# EAGLE design topshell2_actual (EAGLE 9.5.2)
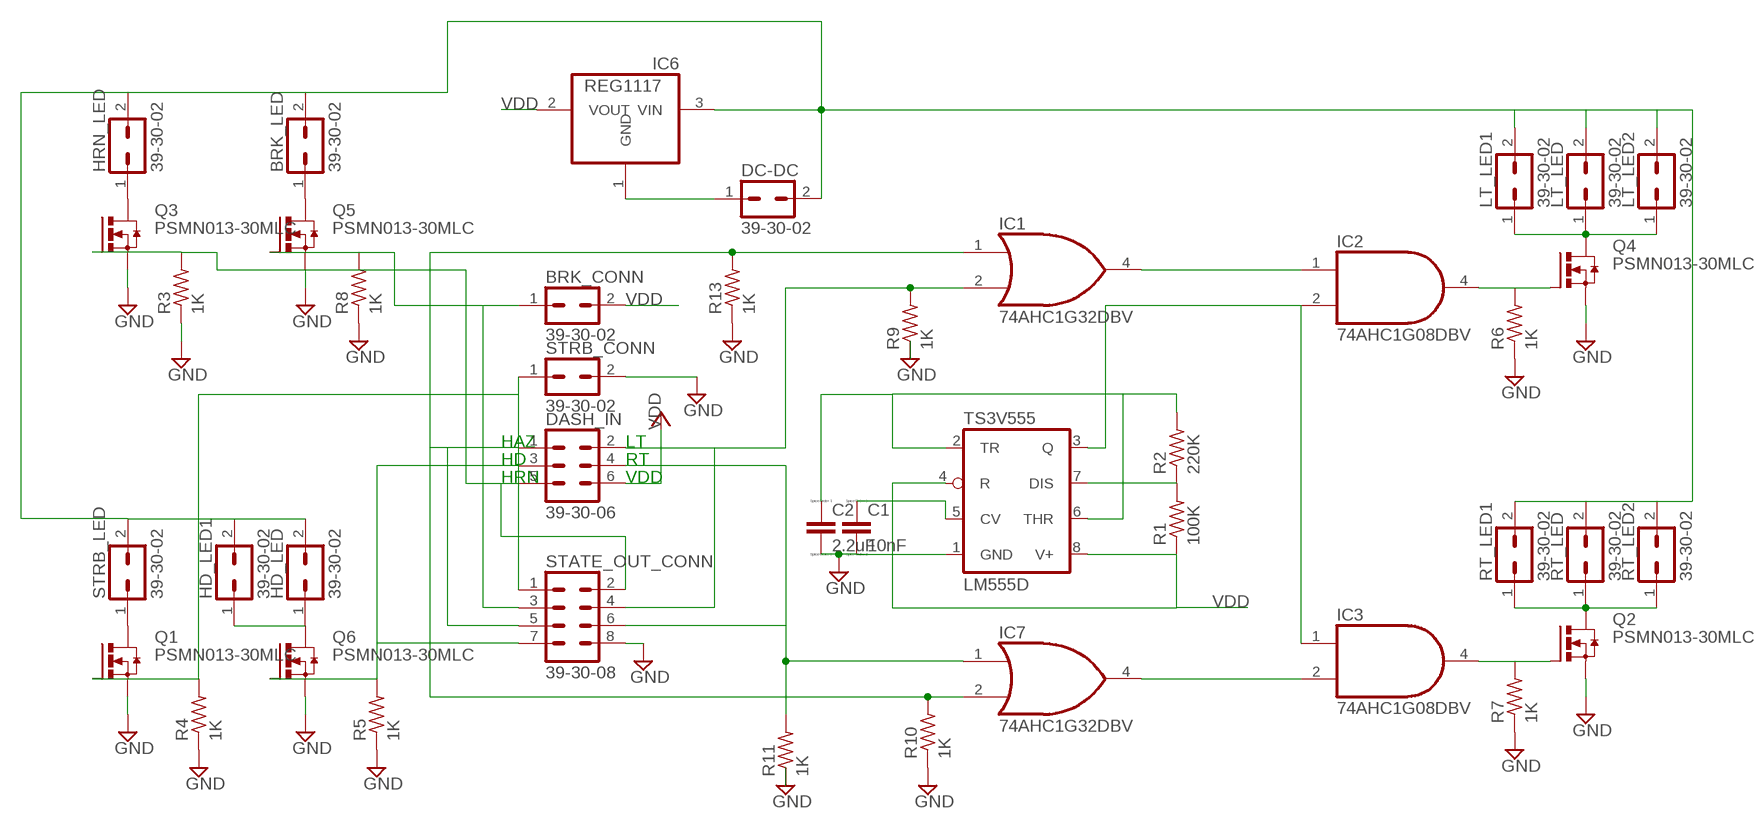
[diagram p0: schematic, sheet 1]

## Parts
BRK_CONN  39-30-02  [39-30-?02?]
BRK_LED  39-30-02  [39-30-?02?]
C1  10nF  C  [C0805]
C2  2.2uF  C  [C0805]
DASH_IN  39-30-06  [39-30-?06?]
DC-DC  39-30-02  [39-30-?02?]
HD_LED  39-30-02  [39-30-?02?]
HD_LED1  39-30-02  [39-30-?02?]
HRN_LED  39-30-02  [39-30-?02?]
IC1  74AHC1G32DBV  [SOT23-5]
IC2  74AHC1G08DBV  [SOT23-5]
IC3  74AHC1G08DBV  [SOT23-5]
IC6  REG1117  [SOT223]
IC7  74AHC1G32DBV  [SOT23-5]
LT_LED  39-30-02  [39-30-?02?]
LT_LED1  39-30-02  [39-30-?02?]
LT_LED2  39-30-02  [39-30-?02?]
Q1  PSMN013-30MLC  [LFPAK33]
Q2  PSMN013-30MLC  [LFPAK33]
Q3  PSMN013-30MLC  [LFPAK33]
Q4  PSMN013-30MLC  [LFPAK33]
Q5  PSMN013-30MLC  [LFPAK33]
Q6  PSMN013-30MLC  [LFPAK33]
R1  100K  R-US_R0805  [R0805]
R2  220K  R-US_R0805  [R0805]
R3  1K  R-US_R0805  [R0805]
R4  1K  R-US_R0805  [R0805]
R5  1K  R-US_R0805  [R0805]
R6  1K  R-US_R0805  [R0805]
R7  1K  R-US_R0805  [R0805]
R8  1K  R-US_R0805  [R0805]
R9  1K  R-US_R0805  [R0805]
R10  1K  R-US_R0805  [R0805]
R11  1K  R-US_R0805  [R0805]
R13  1K  R-US_R0805  [R0805]
RT_LED  39-30-02  [39-30-?02?]
RT_LED1  39-30-02  [39-30-?02?]
RT_LED2  39-30-02  [39-30-?02?]
STATE_OUT_CONN  39-30-08  [39-30-?08?]
STRB_CONN  39-30-02  [39-30-?02?]
STRB_LED  39-30-02  [39-30-?02?]
TS3V555  LM555D  [SO08]

## Nets
GND: C1.2 C2.2 Q1.1(S) Q1.2(S) Q1.3(S) Q2.1(S) Q2.2(S) Q2.3(S) Q3.1(S) Q3.2(S) Q3.3(S) Q4.1(S) Q4.2(S) Q4.3(S) Q5.1(S) Q5.2(S) Q5.3(S) Q6.1(S) Q6.2(S) Q6.3(S) R3.1 R4.1 R5.1 R6.1 R7.1 R8.1 R9.1 R10.1 R11.1 R13.1 STATE_OUT_CONN.8 STRB_CONN.2 TS3V555.1(GND)
N$1: R1.2 R2.1 TS3V555.7(DIS)
N$2: Q1.MB(D) STRB_LED.1
N$3: C2.1 R2.2 TS3V555.2(TR) TS3V555.6(THR)
N$4: IC2.2(I1) IC3.1(I0) TS3V555.3(Q)
N$5: HRN_LED.1 Q3.MB(D)
N$6: Q1.4(G) R4.2 STATE_OUT_CONN.1 STRB_CONN.1
N$7: DASH_IN.2 IC1.2(I1) R9.2 STATE_OUT_CONN.4
N$8: DASH_IN.1 IC1.1(I0) IC7.2(I1) R10.2 R13.2 STATE_OUT_CONN.5
N$9: IC1.4(O) IC2.1(I0)
N$10: IC3.2(I1) IC7.4(O)
N$11: DASH_IN.4 IC7.1(I0) R11.2 STATE_OUT_CONN.6
N$12: IC2.4(O) Q4.4(G) R6.2
N$13: IC3.4(O) Q2.4(G) R7.2
N$14: LT_LED1.1 LT_LED2.1 LT_LED.1 Q4.MB(D)
N$15: Q2.MB(D) RT_LED1.1 RT_LED2.1 RT_LED.1
N$16: BRK_LED.1 Q5.MB(D)
N$17: HD_LED1.1 HD_LED.1 Q6.MB(D)
N$18: DC-DC.1 IC6.1(GND)
N$19: DASH_IN.3 Q6.4(G) R5.2 STATE_OUT_CONN.7
N$20: Q3.4(G) R3.2
N$21: DASH_IN.5 STATE_OUT_CONN.2
N$23: BRK_CONN.1 Q5.4(G) R8.2 STATE_OUT_CONN.3
N$26: BRK_LED.2 DC-DC.2 HD_LED1.2 HD_LED.2 HRN_LED.2 IC6.3(VIN) LT_LED1.2 LT_LED2.2 LT_LED.2 RT_LED1.2 RT_LED2.2 RT_LED.2 STRB_LED.2
TS3V555: C1.1 TS3V555.5(CV)
VDD: BRK_CONN.2 DASH_IN.6 IC6.2(VOUT) R1.1 TS3V555.4(R) TS3V555.8(V+) ; supply symbol labelled VCC

## Notes on the sheet
- HAZ | LT
- HD | RT
- HRN | VDD

## Power pins joined to a net without a drawn wire
GND: IC1.3(GND) IC2.3(GND) IC3.3(GND) IC7.3(GND)
VDD: IC1.5(VCC) IC2.5(VCC) IC3.5(VCC) IC7.5(VCC)

## Library data of the parts
BRK_CONN BRK_LED DC-DC HD_LED HD_LED1 HRN_LED LT_LED LT_LED1 LT_LED2 RT_LED RT_LED1 RT_LED2 STRB_CONN STRB_LED = con-molex-mini-fit:39-30-?02?: HEADER
C1 C2 = eagle-ltspice:C: CAPACITOR, European symbol; SPICEMODEL: NONE; SPICEPREFIX: C
DASH_IN = con-molex-mini-fit:39-30-?06?: HEADER
IC1 IC7 = 74xx-little-us:74*1G32: 2-input OR gate
IC2 IC3 = 74xx-little-us:74*1G08: 2-input AND gate
IC6 = burr-brown:REG1117: 800mA and 1A Low Dropout (LDO) Positive Regulator 1.8V, 2.5V, 2.85V, 3.3V, 5V, and Adj; MPN: REG1117; OC_FARNELL: 1097566; OC_NEWARK: 14P6981
Q1-Q6 = transistor-power:PSMN013-30MLC: N-channel 30 V 13.6 mΩ logic level MOSFET NextPower Technology Source: Data sheet <http://www.nxp.com/documents/data_sheet/PSMN013-30MLC.pdf> PSMN013-30MLC © NXP B.V. 2012. All rights reserved.; MPN: PSMN013-30MLC; OC_FARNELL: 2115260; OC_NEWARK: 05W5709
R1-R11 R13 = rcl:R-US_: RESISTOR, American symbol
STATE_OUT_CONN = con-molex-mini-fit:39-30-?08?: HEADER
TS3V555 = linear:*555: TIMER

## Board
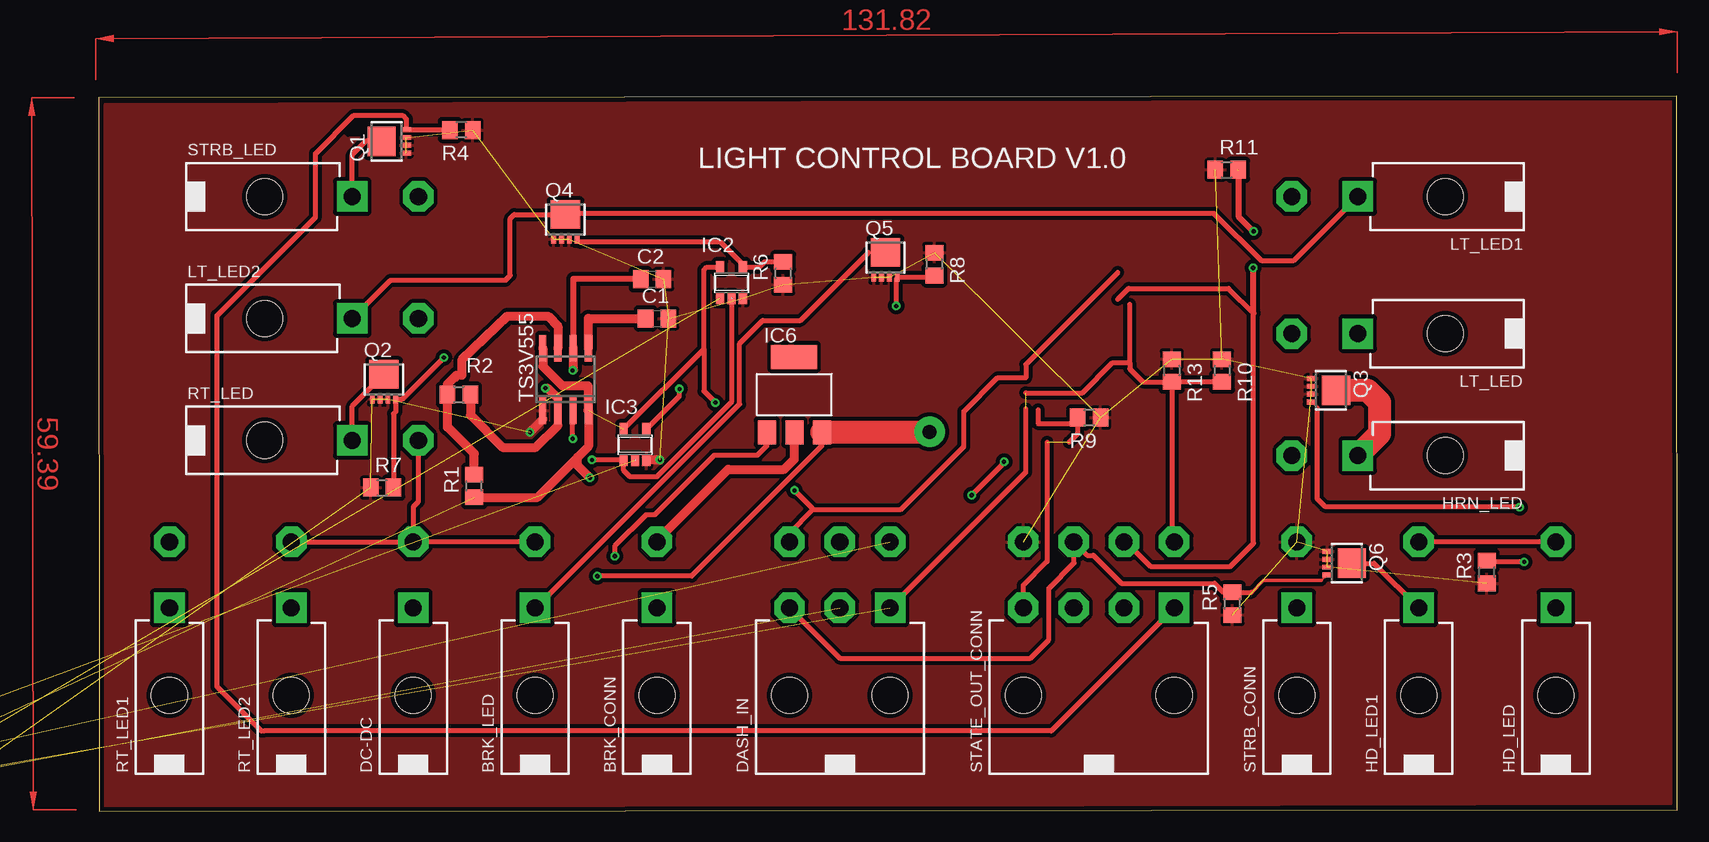
[diagram p1: board, top side]
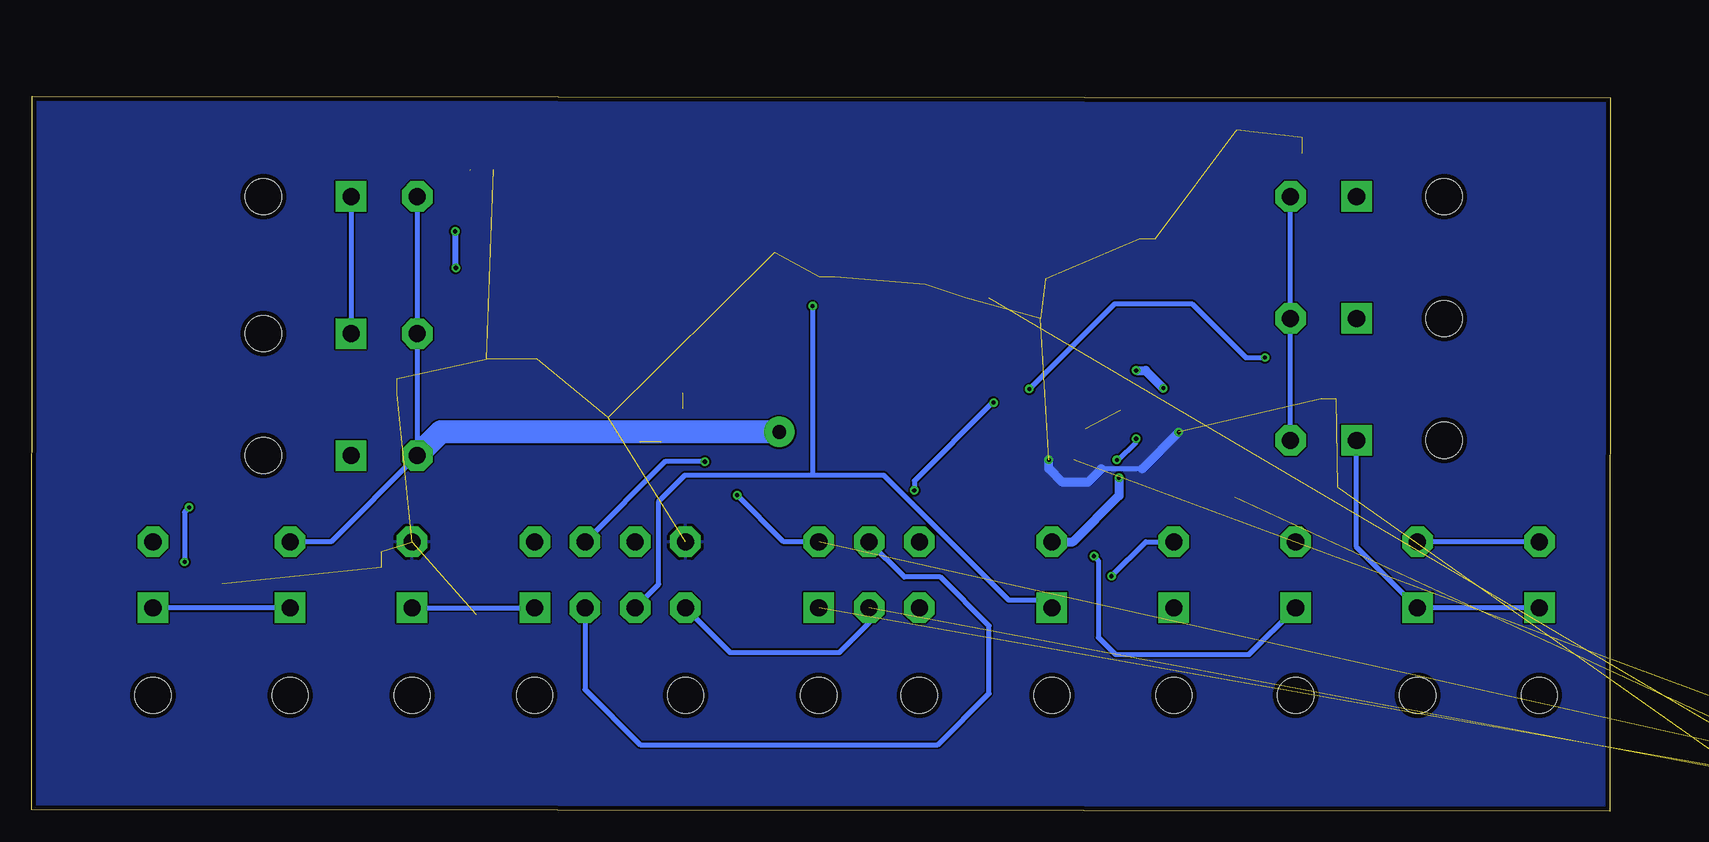
[diagram p2: board, bottom side, seen from below]

Size 131.59 x 59.64 mm. Coordinates in mm from the lower left corner, seen from the top.
Outline: 0.05,0 131.58,0.12 131.54,59.64 0,59.51 0.05,0
Copper layers (1*16): Top 0.0356mm / dielectric 1.5011mm / Bottom 0.0356mm
Design rules "LaenPCBOrder": minimum track width 6mil, minimum drill 13mil, track to track 6mil, track to pad 6mil, pad to pad 6mil, via to via 6mil, smd to smd 6mil, copper to edge 15mil, drill to drill 6mil, minimum pad ring 7mil, minimum via ring 7mil, stop-mask expansion 3mil, vias tented up to drill 0mil, thermal gap 10mil

### Footprints (pad centres in the part's own frame; a part is rotated, then mirrored left to right if it is on the bottom)
39-30-?02? = drill 1.422 pad 2.54 square: 1 0,0 | drill 1.422 pad 2.54 octagon: 2 0,5.512 | hole 3: 0,-7.3
C0805 = smd 1.3 x 1.5: 1 -0.95,0; 2 0.95,0
39-30-?06? = drill 1.422 pad 2.54 square: 1 4.191,0 | drill 1.422 pad 2.54 octagon: 2 0,0; 3 -4.191,0; 4 4.191,5.512; 5 0,5.512; 6 -4.191,5.512 | hole 3: -4.191,-7.3; 4.191,-7.3
SOT23-5 = smd 0.69 x 0.99: 1 -0.95,-1.29; 2 0,-1.29; 3 0.95,-1.29; 4 0.95,1.3; 5 -0.95,1.3
SOT223 = smd 1.499 x 2.007: 1 -2.261,-3.15; 2 0.025,-3.15; 3 2.311,-3.15 | smd 3.81 x 2.007: 4 0,3.15
LFPAK33 = smd 0.4 x 0.8: 1 -0.975,-1.625; 2 -0.325,-1.625; 3 0.325,-1.625; 4 0.975,-1.625 | smd 2.45 x 2.35: MB 0,0.425
R0805 = smd 1.3 x 1.5: 1 -0.95,0; 2 0.95,0
39-30-?08? = drill 1.422 pad 2.54 square: 1 6.287,0 | drill 1.422 pad 2.54 octagon: 2 2.095,0; 3 -2.095,0; 4 -6.287,0; 5 6.287,5.512; 6 2.095,5.512; 7 -2.095,5.512; 8 -6.287,5.512 | hole 3: -6.287,-7.3; 6.287,-7.3
SO08 = smd 0.6 x 2.2: 1 -1.905,-2.6; 2 -0.635,-2.6; 3 0.635,-2.6; 4 1.905,-2.6; 5 1.905,2.6; 6 0.635,2.6; 7 -0.635,2.6; 8 -1.905,2.6

### Placement (x,y rotation side)
BRK_CONN  39-30-02?  [39-30-?02?]  46.54,16.98 0 top
BRK_LED  39-30-02?  [39-30-?02?]  36.38,16.98 0 top
C1  46.54,41.11 0 top
C2  46.13,44.39 0 top
DASH_IN  39-30-06?  [39-30-?06?]  61.78,16.98 0 top
DC-DC  39-30-02?  [39-30-?02?]  26.22,16.98 0 top
HD_LED  39-30-02?  [39-30-?02?]  121.47,16.98 0 top
HD_LED1  39-30-02?  [39-30-?02?]  110.04,16.98 0 top
HRN_LED  39-30-02?  [39-30-?02?]  104.96,29.68 90 top
IC1  -12.39,4.25 0 top  (outside the outline)
IC2  52.75,44.08 0 top
IC3  44.71,30.58 0 top
IC6  57.97,34.76 0 top
IC7  -20.21,4.25 0 top  (outside the outline)
LT_LED  39-30-02?  [39-30-?02?]  104.96,39.84 90 top
LT_LED1  39-30-02?  [39-30-?02?]  104.96,51.27 90 top
LT_LED2  39-30-02?  [39-30-?02?]  21.14,41.11 270 top
Q1  24.02,55.88 90 top
Q2  23.79,36.03 0 top
Q3  102.73,35.13 270 top
Q4  38.91,49.36 0 top
Q5  65.59,46.19 0 top
Q6  104.03,20.7 270 top
R1  31.3,27.14 90 top
R2  30.03,34.76 0 top
R3  115.71,19.97 90 top
R4  30.23,56.83 180 top
R5  94.51,17.33 90 top
R6  57.07,44.87 90 top
R7  23.63,27 0 top
R8  69.66,45.64 270 top
R9  82.57,32.83 180 top
R10  93.64,36.77 270 top
R11  94.03,53.5 0 top
R13  89.44,36.77 270 top
RT_LED  39-30-02?  [39-30-?02?]  21.14,30.95 270 top
RT_LED1  39-30-02?  [39-30-?02?]  5.9,16.98 0 top
RT_LED2  39-30-02?  [39-30-?02?]  16.06,16.98 0 top
STATE_OUT_CONN  39-30-08?  [39-30-?08?]  83.37,16.98 0 top
STRB_CONN  39-30-02?  [39-30-?02?]  99.88,16.98 0 top
STRB_LED  39-30-02?  [39-30-?02?]  21.14,51.27 270 top
TS3V555  38.92,36.03 0 top

### Tracks (layer width: path | path; a pad name or v marks a point on that pad's centre or on a via)
GND  (via drill 0.35)  (35 unrouted)
  Top 0.152: TS3V555.1 37.01,32.69 | v46.78,29.31 46.76,29.29
  Top 0.762: 37.01,32.69 v35.95,31.63 | 46.76,29.29 IC3.3
  Bottom 0.406: 39,28.58 42.41,28.58
  Bottom 0.762: v35.95,31.63 39,28.58 | 42.41,28.58 43.54,27.45 45.64,27.45 46.78,28.59 v46.78,29.31
  pour Top (isolate 0.33): 0.44,0.29 131.12,0.66 131.12,59.34 0.48,58.98 0.48,0.49
  pour Bottom: -0.01,59.54 -0.01,0.01 131.6,0.01 131.61,0.03 131.61,59.56 131.57,59.6 131.49,59.52 0,59.52
N$1
  Top 0.406: R2.1 29.08,34.59 29.05,34.56 | 29.8,36.35 29.8,36.05 30.13,36.38 30.13,36.53 30.27,36.39
  Top 0.762: R1.2 31.3,29.83 29.08,32.05 R2.1 | 29.8,36.35 29.05,35.61 29.05,34.56 | 30.27,36.39 30.27,37.63 34.07,41.29 37.44,41.29 38.28,40.45 TS3V555.7
N$2
  Top 0.152: 23.99,56.33 Q1.MB
  Top 0.406: Q1.MB 22.27,55.88 21.14,54.75 STRB_LED.1
N$3  (via drill 0.35)
  Top 0.152: R2.2 | 38.28,32.2 TS3V555.2 38.28,34.42 | 39.55,36.82 v39.51,36.78
  Top 0.508: C2.1 39.57,44.39 | 39.57,44.39 39.59,44.41 | 39.59,44.41 | 39.59,44.41 39.64,44.35 | 39.57,44.39 39.55,44.37 TS3V555.6
  Top 0.762: R2.2 30.99,33.04 33.68,30.35 36.44,30.35 38.28,32.2 | TS3V555.6 39.55,36.82 | v37.24,35.3 37.4,35.3 38.28,34.42
  Bottom 0.152: 37.26,35.3 v37.24,35.3
  Bottom 0.762: v39.51,36.78 38.74,36.78 37.26,35.3
N$4  (via drill 0.35)
  Top 0.152: IC2.2 | 41.15,29.29 v41.13,29.31 | 39.51,33.38 TS3V555.3
  Top 0.406: IC2.2 52.74,34.13 46.52,27.91 44.29,27.91 43.76,28.44 IC3.1 41.15,29.29 | v39.51,31.08 39.51,33.38
  Bottom 0.152: 39.51,30.82 v39.51,31.08
  Bottom 0.406: v41.13,29.31 41.02,29.31 39.51,30.82
N$5
  Top 1.905: HRN_LED.1 106.76,31.49 106.76,34.12 105.76,35.13 Q3.MB
N$6
  Top 0.152: 13.79,6.73 13.56,6.73
  Top 0.406: STATE_OUT_CONN.1 79.4,6.73 13.79,6.73 | 13.56,6.73 9.87,10.41 9.87,41.36 18.07,49.56 18.07,54.85 21.26,58.05 25.33,58.05 25.64,57.73 Q1.4 29.25,56.85 R4.2
  Bottom 0.406: STRB_CONN.1 STATE_OUT_CONN.1
N$7  (2 unrouted)
  Top 0.406: STATE_OUT_CONN.4 77.08,18.85 79.06,20.83 79.06,30.79 | R9.2 81.62,33.18 | R9.2 81.1,32.32 80.05,32.32 80.05,32.31 78.36,32.31 78.31,32.36 78.31,33.52 | 80.9,30.79 81.62,31.51 R9.2 | R9.2
  Bottom 0.406: STATE_OUT_CONN.4 73.37,13.27 64.25,13.27 61.78,15.74 DASH_IN.2
N$8  (3 unrouted)
  Top 0.152: 89.44,22.7 STATE_OUT_CONN.5
  Top 0.406: R10.2 R13.2 | R13.2 87.04,35.82 85.96,36.9 85.96,37.43 | 85.96,37.43 85.96,42.31 | 77.29,34.91 82,34.91 84.52,37.43 85.96,37.43 | DASH_IN.1 77.29,28.3 77.29,30.89 77.29,32.32 | R13.2 89.5,35.76 89.5,22.65 STATE_OUT_CONN.5 | 77.29,32.32 77.29,33.59 | 77.29,32.32
N$9  (1 unrouted)
N$10  (1 unrouted)
N$11  (via drill 0.35)  (2 unrouted)
  Top 0.152: STATE_OUT_CONN.6 85.63,22.49
  Top 0.406: 85.63,22.49 87.73,20.39 94.29,20.39 96.26,22.36 96.26,41.54 94.19,43.62 85.85,43.62 84.96,42.72 | v72.78,26.37 75.47,29.07 v75.47,29.17
  Top 0.508: 96.26,41.54 96.26,45.29 v96.23,45.32 | 95.02,53.44 95.02,49.62 v96.27,48.37
  Bottom 0.406: DASH_IN.4 68.9,22.49 v72.78,26.37 | v75.47,29.17 78.79,29.17 STATE_OUT_CONN.6
  Bottom 0.508: v96.23,45.32 96.23,48.2 96.27,48.24 v96.27,48.37
N$12
  Top 0.152: IC2.4 53.7,45.61 | 40.14,47.47 Q4.4
  Top 0.406: IC2.4 53.72,45.4 55.1,45.4 55.47,45.77 55.47,45.84 57.04,45.84 R6.2 | 53.7,45.61 53.15,46.16 51.83,47.47 40.14,47.47
N$13  (via drill 0.35)
  Top 0.406: R7.2 24.58,33.16 24.76,33.34 Q2.4 25.34,34.41 v28.78,37.85 | IC3.4 48.41,34.63 v48.41,35.23
  Bottom 0.406: v48.41,35.23 41.29,42.35 34.87,42.35 30.37,37.85 v28.78,37.85
N$14
  Top 0.152: Q4.MB 38.99,49.87
  Top 0.406: 38.79,49.78 Q4.MB 34.64,49.78 34.3,49.45 34.3,44.7 33.89,44.28 24.31,44.28 LT_LED2.1 | 38.99,49.87 92.97,49.87 96.9,45.94 99.62,45.94 LT_LED1.1
  Bottom 0.406: LT_LED1.1 LT_LED.1
N$15
  Top 0.406: RT_LED.1 21.14,33.81 Q2.MB
  Bottom 0.152: 16.23,17.15 RT_LED2.1 16.23,17.15
  Bottom 0.406: 16.23,17.15 21.14,22.06 RT_LED.1 | RT_LED1.1 RT_LED2.1
N$16
  Top 0.152: 64.16,46.61 Q5.MB
  Top 0.406: BRK_LED.1 36.43,16.98 53.42,33.97 53.42,39.02 55.35,40.94 58.49,40.94 64.16,46.61
N$17
  Top 0.406: Q6.MB 106.31,20.7 HD_LED1.1
  Bottom 0.406: HD_LED1.1 HD_LED.1
N$18  (via drill 0.35)
  Top 0.152: IC6.1 55.71,30.52
  Top 0.406: 55.71,30.52 54.88,29.69 51.31,29.69 46.34,24.73 45.63,24.73 43.02,22.13 v43.02,21.28
  Bottom 0.406: DC-DC.1 30.11,13.08 41.24,13.08 42.67,14.51 42.67,20.93 v43.02,21.28
N$19
  Top 0.152: 81.3,22.46 STATE_OUT_CONN.7 | 93.76,18.27 R5.2 | 101.92,19.25 Q6.4
  Top 0.305: 96.11,18.27 97.08,19.25 101.92,19.25
  Top 0.406: 93.76,18.27 93.01,19.02 85.25,19.02 82.9,21.37 82.39,21.37 81.3,22.46 81.3,20.71 79.2,18.61 79.2,14.33 77.66,12.79 61.78,12.79 DASH_IN.3 | R5.2 96.11,18.27
N$20  (via drill 0.35)
  Top 0.152: 101.59,33.67 Q3.4 | 118.36,25.45 v118.45,25.35 | 115.82,20.81 R3.2
  Top 0.406: 101.59,33.67 101.59,26.07 102.2,25.45 114.16,25.45 118.36,25.45 | v118.83,20.81 115.82,20.81
  Bottom 0.406: v118.45,25.35 118.83,24.97 v118.83,20.81
N$21
  Bottom 0.152: 80.86,5.56 80.79,5.49
  Bottom 0.406: STATE_OUT_CONN.2 85.46,10.16 80.86,5.56 56.05,5.56 51.77,9.84 51.77,15.48 55.84,19.54 58.83,19.54 DASH_IN.5
N$23  (via drill 0.35)
  Top 0.152: Q5.4 66.64,44.56 66.49,44.41 | 69.54,44.56 R8.2
  Top 0.406: 66.64,44.56 69.54,44.56 | v66.49,42.15 66.49,44.41
  Bottom 0.152: 66.59,28.04 66.44,28.04 | 66.44,42.11 v66.49,42.15
  Bottom 0.406: STATE_OUT_CONN.3 79.31,18.95 79.31,25.86 77.13,28.04 66.59,28.04 60.56,28.04 50.15,17.64 47.2,17.64 BRK_CONN.1 | 66.44,28.04 66.44,42.11
N$26  (via drill 0.35, 1.14 pad 2.54)
  Top 0.152: 60.26,31.59 IC6.3
  Top 0.406: RT_LED2.2 DC-DC.2 | RT_LED.2 26.64,25.82 26.25,25.43 26.25,23.19 26.22,23.16 DC-DC.2 | BRK_LED.2 DC-DC.2 | HD_LED.2 HD_LED1.2 | 60.26,31.59 60.26,30.47 49.43,19.63 v41.56,19.63
  Top 1.905: IC6.3 60.32,31.65 v69.26,31.65
  Bottom 0.406: RT_LED.2 LT_LED2.2 STRB_LED.2 | RT_LED1.2 RT_LED2.2 | LT_LED1.2 LT_LED.2 HRN_LED.2 106.63,22.49 HD_LED1.2 | v41.56,19.63 38.7,22.49 BRK_LED.2
  Bottom 1.905: v69.26,31.65 97.47,31.65 HRN_LED.2
NOTGND
  cutout Top: 21.41,57.77 25.31,57.77 25.39,57.69 25.39,56.47 20.79,56.47 20.65,56.62 20.65,57.01
TS3V555
  Top 0.762: TS3V555.5 40.82,41.11 C1.1
VDD  (via drill 0.35)  (3 unrouted)
  Top 0.152: TS3V555.8 37.04,38.61 | BRK_CONN.2 46.54,22.6 | 59.54,25.2 59.47,25.13 59.47,25.3
  Top 0.406: 84.96,44.95 77.29,37.28 77.29,36.18 74.93,36.18 72.11,33.35 72.11,30.42 66.89,25.2 59.54,25.2 | 59.47,25.13 57.59,23.24 DASH_IN.6 | IC3.5 50.46,38.58 | 50.46,38.58 50.46,45.16 50.68,45.38 IC2.5 | 50.46,38.58 50.46,35.04 v51.4,34.1 | v58,26.77 59.47,25.3
  Top 0.762: R1.1 36.57,26.19 39.9,29.52 | 39.9,29.52 40.82,30.44 TS3V555.4 40.79,33.46 40.79,35.5 38.64,35.5 37.04,37.11 37.04,38.61 | 46.54,22.6 52.47,28.53 57.14,28.53 57.99,29.38 IC6.2 | v40.94,27.82 39.9,28.87 39.9,29.52
  Bottom 0.152: v51.4,34.1 51.48,34.1
  Bottom 0.406: 51.48,34.1 58,27.57 v58,26.77
  Bottom 0.762: BRK_CONN.2 44.79,22.49 40.94,26.34 v40.94,27.82
(copper drawn outside any net)
  shapes: Top area x2

### Text on the board
tPlace: LIGHT CONTROL BOARD V1.0